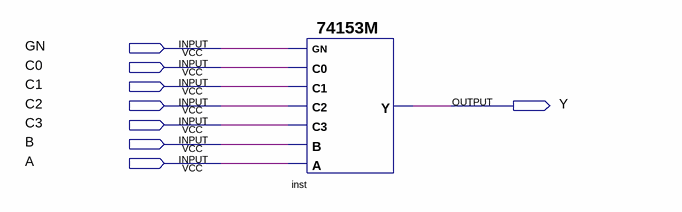
[diagram p0: schematic sheet]
// Quartus schematic Mark11.bdf as structural Verilog: 1 symbols, 8 pins
module Mark11 (
  input  GN,
  input  C0,
  input  C1,
  input  C2,
  input  C3,
  input  B,
  input  A,
  output Y
);

  \74153M  inst (.A(A), .B(B), .C3(C3), .C2(C2), .C1(C1), .C0(C0), .GN(GN), .Y(Y));
endmodule
